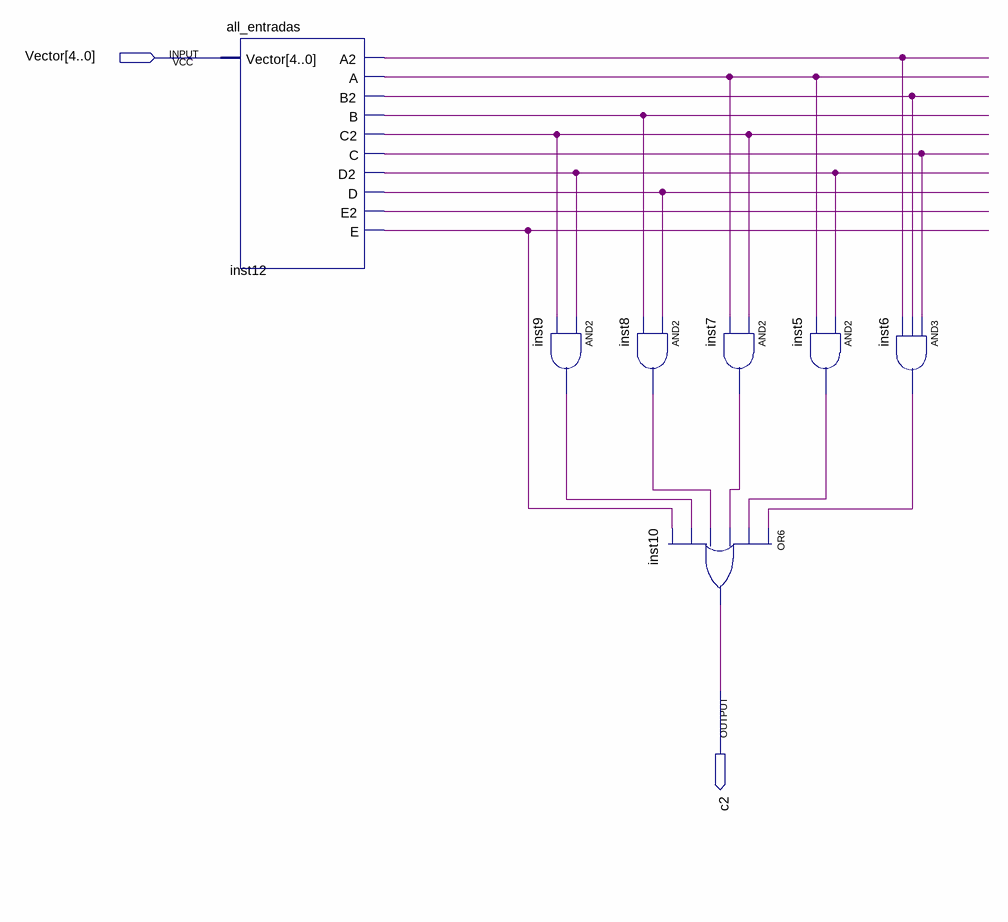
[diagram p0: schematic sheet]
// Quartus schematic c2.bdf as structural Verilog: 7 symbols, 2 pins
module c2 (
  input  [4:0] Vector,
  output c2
);

  wire inst5_out, inst6_out, inst7_out, inst8_out, inst9_out, inst12_a, inst12_a2, inst12_b, inst12_b2,
       inst12_c, inst12_c2, inst12_d, inst12_d2, inst12_e, inst12_e2;

  all_entradas inst12 (
    .Vector(Vector), .A2(inst12_a2), .A(inst12_a), .B2(inst12_b2), .B(inst12_b), .C2(inst12_c2),
    .C(inst12_c), .D2(inst12_d2), .D(inst12_d), .E2(inst12_e2), .E(inst12_e));
  and inst9 (inst9_out, inst12_d2, inst12_c2);
  and inst8 (inst8_out, inst12_d, inst12_b);
  or inst10 (c2, inst6_out, inst5_out, inst7_out, inst8_out, inst9_out, inst12_e);
  and inst7 (inst7_out, inst12_c2, inst12_a);
  and inst5 (inst5_out, inst12_d2, inst12_a);
  and inst6 (inst6_out, inst12_c, inst12_b2, inst12_a2);
endmodule
